# EAGLE board mega2560 (EAGLE 5.11)
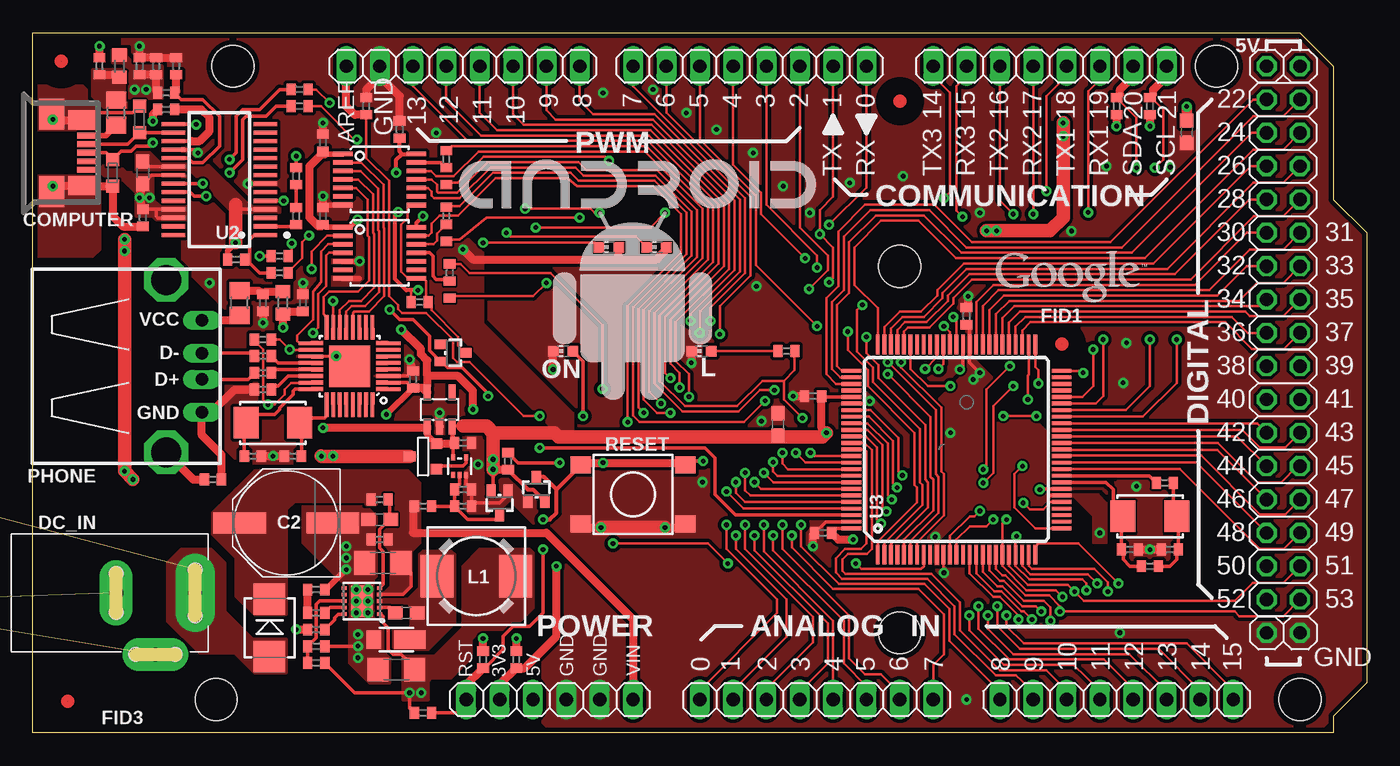
[diagram p2: board, top side]
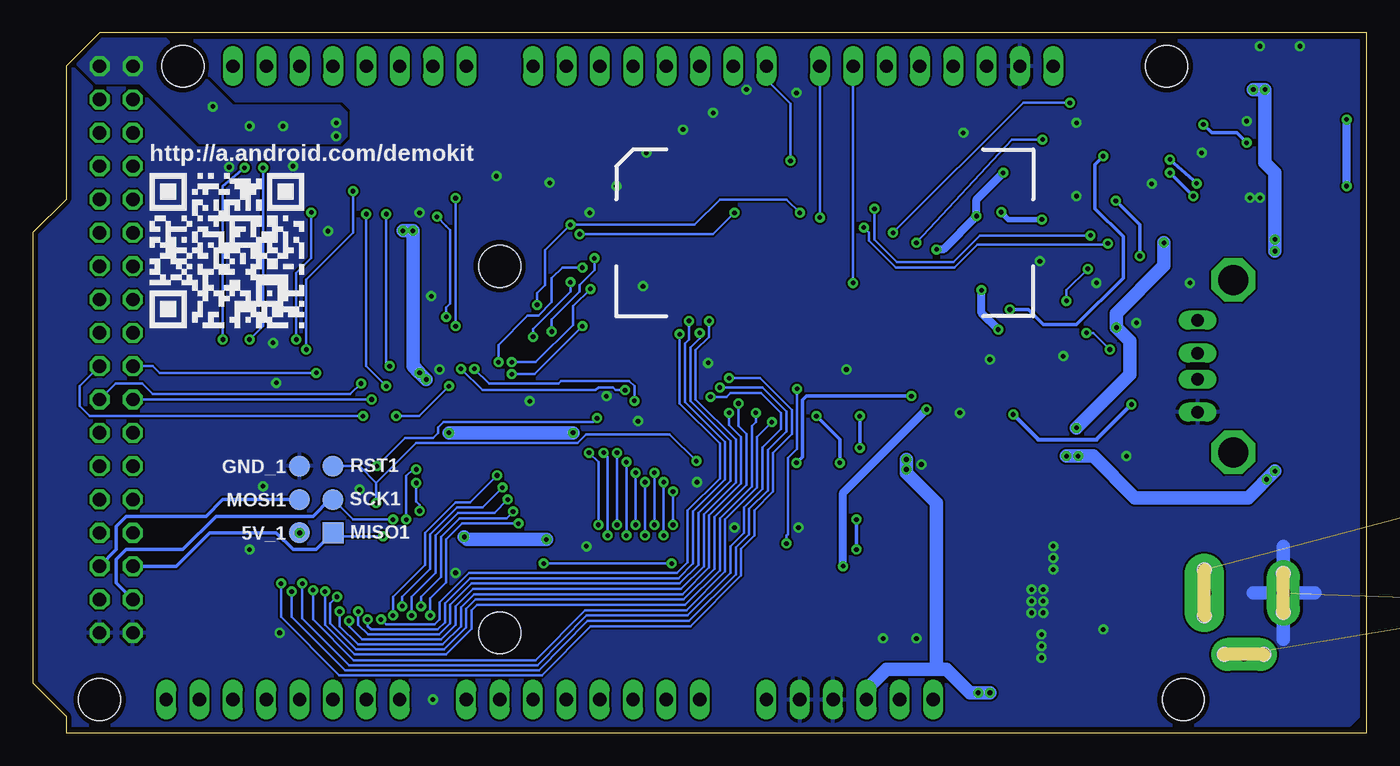
[diagram p3: board, bottom side, seen from below]

Size 101.6 x 53.34 mm. Coordinates in mm from the lower left corner, seen from the top.
Outline: 0,53.34 96.52,53.34 99.06,50.8 99.06,40.64 101.6,38.1 101.6,3.81 99.06,1.27 99.06,0 0,0 0,53.34
Copper layers (1*16): Top 0.035mm / dielectric 1.5mm / Bottom 0.035mm
Design rules "default *": minimum track width 6mil, minimum drill 14mil, track to track 6mil, track to pad 6mil, pad to pad 6mil, via to via 6mil, smd to smd 0mil, copper to edge 15mil, drill to drill 12mil, minimum pad ring 10mil, minimum via ring 8mil, stop-mask expansion 2mil, vias tented up to drill 16mil, thermal gap 10mil
Net classes: 0 default: width 0.152 mm, drill 0.305 mm, clearance 0.152 mm
Holes 3.2 mm at 96.52,2.54 15.24,50.8 90.17,50.8 13.97,2.54 66.04,35.56 66.04,7.62 22.26,-97.56
Holes 0.36 mm at 22.26,-72.16
Holes 0.95 mm at 22.26,-77.24
Holes 1.02 mm at 22.26,-82.32
Holes 1.04 mm at 22.26,-87.4
Holes 2.3 mm at 22.26,-92.48
Milling: 7 lines

## Footprints (pad centres in the part's own frame; a part is rotated, then mirrored left to right if it is on the bottom)
TP16R = smd 1.6 x 1.6: TP 0,0
1X08 = drill 1.016 long: 1 -8.89,0; 2 -6.35,0; 3 -3.81,0; 4 -1.27,0; 5 1.27,0; 6 3.81,0; 7 6.35,0; 8 8.89,0
C0603 = smd 1.1 x 1: 1 -0.85,0; 2 0.85,0
PANASONIC_F = smd 4 x 1.6: + 3.55,0; - -3.55,0
C1206 = smd 1.6 x 1.8: 1 -1.4,0; 2 1.4,0
C0402 = smd 0.7 x 0.9: 1 -0.65,0; 2 0.65,0
MOLEX-47364-0001 = smd 1.7 x 0.45: 1 2.8,1.3; 2 2.8,0.65; 3 2.8,0; 4 2.8,-0.65; 5 2.8,-1.3 | smd 1.9 x 2.375: GND1 0,2.95; GND4 0,-2.95 | smd 2.1 x 1.475: GND2 2.3,2.5; GND3 2.3,-2.5
SMB = smd 2.4 x 2.4: A 2.2,0; C -2.2,0
SOD123PWR = smd 1.1 x 1.4: A -1.7,0 | smd 2.4 x 1.4: K 1.05,0
SC70-3-R = smd 0.7 x 0.9: 1 -0.65,-0.95; 2 0.65,-0.95; 3 0,0.95
DC21 = drill 1.041 pad 3 long: 1 6,0 | drill 1.041 pad 2.5 long: 2 0,0; 3 3,-4.7 | hole 1.041: 0,1.499; 0,-1.499; 6,1.753; 6,-1.753; 1.5,-4.7; 4.5,-4.7
R0805 = smd 1.3 x 1.5: 1 -0.95,0; 2 0.95,0
R0603 = smd 1 x 1.1: 1 -0.85,0; 2 0.85,0
1X01 = drill 1.016 octagon: 1 0,0
CHIP-LED0603 = smd 0.8 x 0.8: A 0,-0.75; C 0,0.75
DR74 = smd 2.5 x 3.25: 1 -3,0; 2 3,0
TP16SQ = smd 1.6 x 1.6: TP 0,0
PN87520 = drill 0.95 long: 1 -3.5,2.71; 2 -1,2.71; 3 1,2.71; 4 3.5,2.71 | drill 2.3 octagon: SG1 -6.57,0; SG2 6.57,0
1X06 = drill 1.016 long: 1 -6.35,0; 2 -3.81,0; 3 -1.27,0; 4 1.27,0; 5 3.81,0; 6 6.35,0
R0402 = smd 0.7 x 0.9: 1 -0.65,0; 2 0.65,0
J0402 = smd 0.7 x 0.9: 1 -0.65,0; 2 0.65,0; 3 1.95,0
B3S-10XX = smd 1.55 x 1.3: 1 3.975,-2.25; 2 -3.975,-2.25; 3 3.975,2.25; 4 -3.975,2.25
SOT-23 = smd 0.787 x 0.889: 1 0.025,-1.016; 2 -0.94,1.016; 3 0.991,1.016
LT-DD-10P-3MMX3MM-SLUG = smd 0.25 x 0.45: 1 -1,-1.35; 2 -0.5,-1.35; 3 0,-1.35; 4 0.5,-1.35; 5 1,-1.35; 6 1,1.35; 7 0.5,1.35; 8 0,1.35; 9 -0.5,1.35; 10 -1,1.35 | smd 2.38 x 1.65: EXP 0,0
SSOP28 = smd 1.8 x 0.317: 1 -3.5,4.225; 2 -3.5,3.575; 3 -3.5,2.925; 4 -3.5,2.275; 5 -3.5,1.625; 6 -3.5,0.975; 7 -3.5,0.325; 8 -3.5,-0.325; 9 -3.5,-0.975; 10 -3.5,-1.625; 11 -3.5,-2.275; 12 -3.5,-2.925; 13 -3.5,-3.575; 14 -3.5,-4.225; 15 3.5,-4.225; 16 3.5,-3.575; 17 3.5,-2.925; 18 3.5,-2.275; 19 3.5,-1.625; 20 3.5,-0.975; 21 3.5,-0.325; 22 3.5,0.325; 23 3.5,0.975; 24 3.5,1.625; 25 3.5,2.275; 26 3.5,2.925; 27 3.5,3.575; 28 3.5,4.225
TQFP100 = smd 1.5 x 0.29: 1 -8,6; 2 -8,5.5; 3 -8,5; 4 -8,4.5; 5 -8,4; 6 -8,3.5; 7 -8,3; 8 -8,2.5; 9 -8,2; 10 -8,1.5; 11 -8,1; 12 -8,0.5; 13 -8,0; 14 -8,-0.5; 15 -8,-1; 16 -8,-1.5; 17 -8,-2; 18 -8,-2.5; 19 -8,-3; 20 -8,-3.5; 21 -8,-4; 22 -8,-4.5; 23 -8,-5; 24 -8,-5.5; 25 -8,-6; 51 8,-6; 52 8,-5.5; 53 8,-5; 54 8,-4.5; 55 8,-4; 56 8,-3.5; 57 8,-3; 58 8,-2.5; 59 8,-2; 60 8,-1.5; 61 8,-1; 62 8,-0.5; 63 8,0; 64 8,0.5; 65 8,1; 66 8,1.5; 67 8,2; 68 8,2.5; 69 8,3; 70 8,3.5; 71 8,4; 72 8,4.5; 73 8,5; 74 8,5.5; 75 8,6 | smd 0.29 x 1.5: 26 -6,-8; 27 -5.5,-8; 28 -5,-8; 29 -4.5,-8; 30 -4,-8; 31 -3.5,-8; 32 -3,-8; 33 -2.5,-8; 34 -2,-8; 35 -1.5,-8; 36 -1,-8; 37 -0.5,-8; 38 0,-8; 39 0.5,-8; 40 1,-8; 41 1.5,-8; 42 2,-8; 43 2.5,-8; 44 3,-8; 45 3.5,-8; 46 4,-8; 47 4.5,-8; 48 5,-8; 49 5.5,-8; 50 6,-8; 76 6,8; 77 5.5,8; 78 5,8; 79 4.5,8; 80 4,8; 81 3.5,8; 82 3,8; 83 2.5,8; 84 2,8; 85 1.5,8; 86 1,8; 87 0.5,8; 88 0,8; 89 -0.5,8; 90 -1,8; 91 -1.5,8; 92 -2,8; 93 -2.5,8; 94 -3,8; 95 -3.5,8; 96 -4,8; 97 -4.5,8; 98 -5,8; 99 -5.5,8; 100 -6,8
SOT-553 = smd 0.3 x 0.45: 1 -0.5,-0.675; 2 0,-0.675; 3 0.5,-0.675; 4 0.5,0.675; 5 -0.5,0.675
SOT23-DBV = smd 0.55 x 1.2: 1 -0.95,-1.3; 2 0,-1.3; 3 0.95,-1.3; 4 0.95,1.3; 5 -0.95,1.3
TSSOP14 = smd 0.35 x 1.5: 1 -1.95,-2.8; 2 -1.3,-2.8; 3 -0.65,-2.8; 4 0,-2.8; 5 0.65,-2.8; 6 1.3,-2.8; 7 1.95,-2.8; 8 1.95,2.8; 9 1.3,2.8; 10 0.65,2.8; 11 0,2.8; 12 -0.65,2.8; 13 -1.3,2.8; 14 -1.95,2.8
TQFP32-05 = smd 0.27 x 1.45: 1 -1.75,-3.16; 2 -1.25,-3.16; 3 -0.75,-3.16; 4 -0.25,-3.16; 5 0.25,-3.16; 6 0.75,-3.16; 7 1.25,-3.16; 8 1.75,-3.16; 17 1.75,3.16; 18 1.25,3.16; 19 0.75,3.16; 20 0.25,3.16; 21 -0.25,3.16; 22 -0.75,3.16; 23 -1.25,3.16; 24 -1.75,3.16 | smd 1.45 x 0.27: 9 3.16,-1.75; 10 3.16,-1.25; 11 3.16,-0.75; 12 3.16,-0.25; 13 3.16,0.25; 14 3.16,0.75; 15 3.16,1.25; 16 3.16,1.75; 25 -3.16,1.75; 26 -3.16,1.25; 27 -3.16,0.75; 28 -3.16,0.25; 29 -3.16,-0.25; 30 -3.16,-0.75; 31 -3.16,-1.25; 32 -3.16,-1.75
TQFN-32 = smd 0.3 x 0.9: 1 -1.75,-2.465; 2 -1.25,-2.465; 3 -0.75,-2.465; 4 -0.25,-2.465; 5 0.25,-2.465; 6 0.75,-2.465; 7 1.25,-2.465; 8 1.75,-2.465; 17 1.75,2.465; 18 1.25,2.465; 19 0.75,2.465; 20 0.25,2.465; 21 -0.25,2.465; 22 -0.75,2.465; 23 -1.25,2.465; 24 -1.75,2.465 | smd 0.9 x 0.3: 9 2.465,-1.75; 10 2.465,-1.25; 11 2.465,-0.75; 12 2.465,-0.25; 13 2.465,0.25; 14 2.465,0.75; 15 2.465,1.25; 16 2.465,1.75; 25 -2.465,1.75; 26 -2.465,1.25; 27 -2.465,0.75; 28 -2.465,0.25; 29 -2.465,-0.25; 30 -2.465,-0.75; 31 -2.465,-1.25; 32 -2.465,-1.75 | smd 3.15 x 3.15: PAD 0,0
XTAL5032 = smd 1.9 x 2.4: 1 -2.05,0; 2 2.05,0
2X08 = drill 1.016 octagon: 1 -8.89,-1.27; 2 -8.89,1.27; 3 -6.35,-1.27; 4 -6.35,1.27; 5 -3.81,-1.27; 6 -3.81,1.27; 7 -1.27,-1.27; 8 -1.27,1.27; 9 1.27,-1.27; 10 1.27,1.27; 11 3.81,-1.27; 12 3.81,1.27; 13 6.35,-1.27; 14 6.35,1.27; 15 8.89,-1.27; 16 8.89,1.27
CT/CN0603 = smd 1 x 1: 1 -1,0; 2 1,0

## Placement (x,y rotation side)
5V_1  TPTP16R  [TP16R]  81.28,15.24 0 bottom
ADCH  [1X08]  82.55,2.54 0 top
ADCL  [1X08]  59.69,2.54 0 top
C1  0.47uF  [C0603]  28.45,9.14 0 top
C2  22uF  [PANASONIC_F]  19.3,16 180 top
C3  4.7uF  [C1206]  26.67,12.95 180 top
C4  220nF  [C0603]  26.42,16.26 180 top
C5  470pF  [C0402]  21.59,10.92 0 top
C6  22uF  [C1206]  27.69,4.83 180 top
C7  10nF  [C0402]  5.08,50.8 90 top
C8  100nF  [C0402]  8.13,50.8 90 top
C9  100nF  [C0402]  10.92,50.8 90 top
C10  100pF  [C0402]  34.29,5.59 90 top
C11  100nF  [C0402]  20.07,42.42 90 top
C12  4.7pF  [C0402]  86.61,13.97 180 top
C13  4.7pF  [C0402]  83.57,13.97 0 top
C14  100nF  [C0402]  10.16,47.5 180 top
C15  100nF  [C0402]  71.12,31.75 90 top
C16  100nF  [C0402]  59.44,25.65 180 top
C17  100nF  [C0402]  60.2,15.24 180 top
C18  1uF  [C0603]  8.38,42.67 270 top
C19  100nF  [C0402]  8.38,39.24 90 top
C20  100nF  [C0402]  25.4,47.75 90 top
C21  100nF  [C0402]  32.77,22.1 180 top
C22  100nF  [C0402]  32.77,18.54 180 top
C23  100nF  [C0402]  36.83,5.59 270 top
C24  10nF  [C0402]  17.53,32.77 270 top
C25  100nF  [C0402]  20.57,32.77 90 top
C26  100nF  [C0402]  22.1,44.96 90 top
C27  13pF  [C0402]  19.81,21.08 180 top
C28  13pF  [C0402]  16.76,21.08 0 top
C29  100nF  [C0402]  22.1,39.37 90 top
C30  100nF  [C0402]  17.53,26.16 180 top
C31  100nF  [C0402]  28.96,26.92 90 top
C32  100nF  [C0402]  13.72,19.3 180 top
C33  100nF  [C0402]  27.94,45.97 90 top
C34  1uF  [C0603]  56.77,23.5 90 top
C35  1uF  [C0603]  87.88,45.8 270 top
COMMUNICATION  [1X08]  77.47,50.8 180 top
COMPUTER  MOLEX-47346-0001  [MOLEX-47364-0001]  1.45,44.2 0 top
D1  SK310B  [SMB]  18.03,8 270 top
D2  DFLS240L  [SOD123PWR]  27.69,7.11 0 top
D3  MMBD7000  [SC70-3-R]  35.56,17.53 180 top
D4  MMBD7000  [SC70-3-R]  32,28.96 270 top
D5  MMBD7000  [SC70-3-R]  38.35,18.54 0 top
DC_IN  PJ-202A  [DC21]  6.35,10.67 0 top
F1  MF-PSMF050X  [R0805]  6.35,47.24 90 top
F2  MF-PSMF050X  [R0805]  15.75,32.77 90 top
FB1  120R  [R0603]  6.6,50.8 90 top
FB2  120R  [R0603]  19.05,32.77 270 top
FID1  [FIDUCIAL_L]  78.38,29.62 0 top
FID2  [FIDUCIAL_R]  2.16,51.18 0 top
FID3  [FIDUCIAL_R]  2.67,2.41 0 top
FID4  [FIDUCIAL_L]  66.04,48.13 0 top
GND_1  TPTP16R  [TP16R]  81.28,20.32 0 bottom
JP1  [1X01]  93.98,50.8 0 top
JP2  [1X01]  96.52,50.8 0 top
JP3  [1X01]  93.98,7.62 0 top
JP4  [1X01]  96.52,7.62 0 top
L  YELLOW  [CHIP-LED0603]  50.93,29.08 90 top
L1  6.8uH  [DR74]  33.78,11.94 0 top
MISO1  TPTP16SQ  [TP16SQ]  78.74,15.24 0 bottom
MOSI1  TPTP16R  [TP16R]  81.28,17.78 0 bottom
ON  GREEN  [CHIP-LED0603]  40.39,29.08 90 top
PHONE  [PN87520]  10.16,27.94 270 top
POWER  [1X06]  39.37,2.54 0 top
PWMH  [1X08]  32.77,50.8 180 top
PWML  [1X08]  54.61,50.8 180 top
R1  16K2  [R0402]  26.42,17.78 180 top
R2  16K2  [R0402]  26.42,14.73 0 top
R3  16K2  [R0402]  21.59,9.14 0 top
R4  536K  [R0402]  21.59,5.33 180 top
R5  1K0  [R0402]  20.32,49.02 0 top
R6  1K0  [R0402]  20.32,47.75 0 top
R7  100K  [R0402]  21.59,6.6 180 top
R8  40K2  [R0402]  21.59,7.87 0 top
R9  1K0  [R0402]  10.16,48.77 0 top
R10  11K  [R0402]  9.4,50.8 270 top
R11  11K  [R0402]  29.72,1.52 180 top
R12  1K0  [R0402]  36.2,20.7 90 top
R13  NOLOAD  [R0402]  85.09,12.7 180 top
R14  100R  [R0402]  20.07,39.37 90 top
R15  33R  [R0402]  86.23,19.05 0 top
R16  1K0  [R0402]  57.4,29.08 180 top
R17  1K0  [R0402]  18.8,36.32 180 top
R18  1K0  [R0402]  18.8,35.05 180 top
R19  11K  [R0402]  29.72,17.27 180 top
R20  5K9  [R0402]  32.77,17.27 180 top
R21  4K7  [R0402]  17.53,29.97 180 top
R22  33R  [J0402]  31.5,42.42 90 top
R23  33R  [R0402]  17.53,28.7 0 top
R24  33R  [R0402]  17.53,27.43 0 top
R25  4K7  [R0402]  85.09,47.75 270 top
R26  4K7  [R0402]  82.55,47.75 270 top
R27  33R  [J0402]  31.5,38.1 90 top
R28  33R  [J0402]  31.75,33.78 90 top
R29  11K  [R0402]  29.46,32.82 0 top
R30  4K7  [R0402]  15.49,36.07 180 top
RESET  B3S-1000  [B3S-10XX]  45.72,18.16 0 top
RST1  TPTP16R  [TP16R]  78.74,20.32 0 bottom
RX  YELLOW  [CHIP-LED0603]  47.5,37.01 90 top
SCK1  TPTP16R  [TP16R]  78.74,17.78 0 bottom
T1  FDN340P  [SOT-23]  29.72,21.08 270 top
TX  YELLOW  [CHIP-LED0603]  43.87,37.01 90 top
U1  LT3480EDD  [LT-DD-10P-3MMX3MM-SLUG]  25.06,10.05 90 top
U2  FT232R  [SSOP28]  14.22,42.16 180 top
U3  ATMEGA1280-16AU  [TQFP100]  70.36,21.59 90 top
U4  74LVC1G17  [SOT-553]  32.51,20.32 0 top
U5  LP2985-33DBVR  [SOT23-DBV]  30.99,24.64 0 top
U6  TXB0104PWR  [TSSOP14]  26.42,42.16 270 top
U7A  MAX3421EEHJ  [TQFP32-05]  24.13,27.94 90 top
U7B  [TQFN-32]  24.13,27.94 90 top
U8  TXB0104PWR  [TSSOP14]  26.42,36.58 270 top
U$1  [A3L-LOC]  -50.8,-167.64 0 top  (outside the outline)
U$3  [QR_AAA_FINAL]  93.09,30.48 0 bottom
U$4  [GOOGLE_10]  72.82,33.22 0 top
U$5  [ANDROID_MARK_25]  32.49,39.98 0 top
U$7  [ROBOT_50_EYES]  39.62,25.4 0 top
X1  16MHz  [XTAL5032]  85.09,16.51 180 top
X2  12MHz  [XTAL5032]  18.29,23.62 0 top
XIOH  [2X08]  95.25,39.37 90 top
XIOL  [2X08]  95.25,19.05 90 top
Z1  PGB1010604  [CT/CN0603]  8.13,46.74 270 top
Z2  PGB1010604  [CT/CN0603]  6.1,42.67 90 top

## Tracks (layer width: path | path; a pad name or v marks a point on that pad's centre or on a via)
+3V3  (via drill 0.36)
  Top 0.203: R21.2 16.88,29.86 17.53,29.21 17.53,25.4 v17.91,25.02 18.41,25.02 19.18,25.78 19.18,26.16 19.68,26.67 20.44,26.67 U7A.23 | R29.1 28.81,33.67 28.75,33.73
  Top 0.254: C31.1 28.54,26.69 U7A.2 U7B.2 | U7A.23 U7B.23
  Top 0.305: v29.34,33.73 28.75,33.73 28.45,33.73 27.58,34.59 27.58,39.42 v27.84,39.67
  Top 0.406: U6.1 22.29,44.11 C26.1 | C29.1 22.29,38.53 U8.1 24.15,38.53 v24.74,39.12 | v26.92,24.26 26.92,24.24 C31.1
  Top 0.61: POWER.2 35.56,3.68 36.81,4.94 C23.2 37.45,4.94 39.88,7.37 v39.88,12.7 | 29.7,26.27 C31.1 | 29.7,26.27 U5.5 | v33.53,24.64 33.53,26.06 32.41,27.18 30.09,27.18 30.04,27.23 | 22.29,44.11 22.02,44.11 21.08,43.18 21.08,39.27 21.74,38.61 21.99,38.61 C29.1 | 30.04,27.23 30.04,26.48 29.83,26.27 29.7,26.27 | v28.07,30.73 29.57,29.23 29.57,28.85 30.04,28.38 30.04,27.23
  Bottom 0.305: v26.92,24.26 25.02,22.35 20.57,22.35 v17.91,25.02
  Bottom 0.406: v24.74,39.12 27.28,39.12 v27.84,39.67
  Bottom 0.61: v33.53,24.64 39.88,18.29 v39.88,12.7 | v28.07,30.73 29.34,32 v29.34,33.73
+5V  (via drill 0.36)
  Top 0.254: U2.20 8.77,43.14 C18.1 | 34.8,18.59 D3.2 35.05,18.62 v35.05,20.07 | U5.3 31.94,22.28 C21.2 32.01,21.99 U4.5 32.01,23.36 32,23.37 32.77,23.37 | R4.1 24.53,3.05 v28.7,3.05 28.7,1.89 R11.2 | U1.1 26.51,9.05 26.67,8.89 26.67,8.38 27.05,8 27.05,6.35 27.43,5.97 28.07,5.97 28.57,5.46 28.57,5.34 C6.1 | U3.100 61.2,15.59 C17.1 | C15.1 71.36,30.86 U3.61 71.36,28.21 v72.14,27.43 | U3.80 60.15,25.59 C16.1 | U3.31 77.53,18.09 | U2.4 15.76,39.89 15.49,39.62 15.49,37.59 v15.44,37.34 | U8.14 29.22,38.89 29.69,39.37 | C34.1 56.49,22.64 56.49,22.55
  Top 0.305: 28.11,44.11 U6.14 | 28.11,44.11 27.69,43.69 v27.69,42.67 | U8.14 29.22,38.87 v29.72,39.37 | 28.11,44.11 27.94,44.29 C33.1 | D5.2 38.75,17.89 38.1,18.54 37.7,18.54 R12.1
  Top 0.406: U5.1 30.04,22.72 T1.2 | R30.2 14.84,36.74 v15.44,37.34
  Top 0.61: C25.1 19.25,32.12 FB2.2 v19.05,30.89 | T1.2 32.04,22.02 C21.2 | v35.05,20.07 36.18,20.07 R12.1 | 62.51,14.79 v62.48,14.73 61.36,14.73 C17.1 | C16.1 60.09,23.23 v60.45,22.86 | R26.2 v82.55,46.23 | R25.2 v85.09,46.23 | U5.1 30.04,23.18 29.97,23.24 v22.1,23.24 | RX.A 48.25,36.82 47.5,36.07 44.7,36.07 | TX.A 44.62,36.16 44.7,36.07 | 44.7,36.07 33.53,36.07 v32.77,36.83
  Top 0.813: C35.1 v87.88,47.73
  Top 1.016: v35.05,20.07 v35.05,20.83 35.05,22.86 | 32.77,23.37 34.54,23.37 35.05,22.86 | 35.05,22.86 39.73,22.86 40.03,22.55 56.49,22.55 60.15,22.55 v60.45,22.86 | v78.49,46.48 v78.49,45.47 78.49,39.27 77.47,38.25 v73.41,38.25 v72.64,38.25 | v15.44,37.34 15.44,40.23
  Bottom 0.61: v27.69,42.67 29.72,40.64 v29.72,39.37 32.26,36.83 v32.77,36.83
  Bottom 1.016: v29.59,3.05 v28.7,3.05 30.23,3.05 32,4.83 32.77,4.83 | 32.77,4.83 36.58,4.83 38.1,3.3 POWER.3 | 32.77,4.83 32.77,17.53 35.05,19.81 v35.05,20.07 v35.05,20.83 | v73.41,38.25 v72.64,38.25 72.64,27.94 v72.14,27.43 v71.63,26.92 | v60.45,22.86 v69.9,22.86 | v15.44,37.34 15.44,35.61 15.49,35.56 19.05,31.95 v19.05,30.89 18.03,29.87 18.03,27.3 v22.1,23.24 | v68.73,14.94 68.53,14.73 v62.48,14.73
  other vias: 81.28,15.24
  pour Top (no thermals): 37.85,13.97 34.04,13.97 32.77,12.7 32.77,8 30.61,5.84 28.32,5.84 28.19,5.71 28.19,2.54 30.1,2.54 30.1,3.94 30.35,4.19 31.88,4.19 33.4,5.71 33.4,7.11 34.16,7.87 36.45,7.87 38.1,9.53 38.1,13.72
  pour Top (no thermals): 7.87,43.94 7.87,42.93 11.94,42.93 12.7,42.16 12.95,42.16 13.72,41.4 13.72,41.15 15.24,39.62 18.8,39.62 18.8,40.13 16.51,40.13 12.95,43.69 11.94,43.69 11.68,43.43 9.65,43.43 8.89,44.2 7.87,44.2
  pour Bottom (no thermals): 96.52,53.09 91.69,53.09 86.36,47.75 78.23,47.75 77.72,47.24 77.72,45.47 78.23,44.96 88.9,44.96 93.47,49.53 96.77,49.53 98.3,51.05 98.3,51.31
  pour Top (no thermals): 77.34,18.16 81.15,18.16 81.79,17.53 81.79,14.48 80.77,14.48 80.77,16.51 79.25,18.03 77.6,18.03 76.58,17.02 71.37,17.02 69.09,14.73 69.09,12.83 68.71,12.83 68.68,14.22 68.2,14.71 68.2,16.28 67.44,16.94 67.44,23.88 71.12,27.56 71.12,31.37 71.5,31.37 71.5,28.7 77.34,22.86
  pour Top (no thermals): 41.15,22.48 35.43,22.48 35.43,19.81 35.18,19.56 34.92,19.56 34.67,19.81 34.67,23.24 39.24,23.24 39.37,23.37 29.97,32.77 29.97,35.81 32,37.85 33.02,37.85 34.29,36.58 34.29,31.24 41.15,24.38
ADC0  (via drill 0.36)
  Top 0.203: v52.83,18.39 54.13,17.09 U3.97 | v52.83,15.85 52.83,14.02 56.69,10.16 56.69,9.14 50.8,3.25 ADCL.1
  Bottom 0.203: v52.83,15.85 v52.83,18.39
ADC1  (via drill 0.36)
  Top 0.203: U3.96 54.24,17.59 53.54,18.29 v53.54,19.1 | ADCL.2 53.34,3.25 57.4,7.32 57.4,10.16 53.54,14.02 v53.54,15.04
  Bottom 0.203: v53.54,15.04 v53.54,19.1
ADC2  (via drill 0.36)
  Top 0.203: v54.25,19.81 54.25,18.49 54.66,18.09 U3.95 | v54.25,15.85 54.25,14.02 59.44,8.84 59.44,6.91 55.88,3.35 ADCL.3
  Bottom 0.203: v54.25,15.85 v54.25,19.81
ADC3  (via drill 0.36)
  Top 0.203: v54.97,19.1 55.48,18.59 U3.94 | ADCL.4 58.42,3.15 60.55,5.28 60.55,8.33 54.97,13.92 v54.97,15.04
  Bottom 0.203: v54.97,15.04 v54.97,19.1
ADC4  (via drill 0.36)
  Top 0.203: ADCL.5 60.96,8.53 55.68,13.82 v55.68,15.85 | v55.68,19.81 56.4,19.09 U3.93
  Bottom 0.203: v55.68,15.85 v55.68,19.81
ADC5  (via drill 0.36)
  Top 0.203: ADCL.6 63.5,3.56 61.77,5.28 61.77,8.53 56.39,13.92 v56.39,15.04 | v56.39,20.62 56.39,19.91 56.71,19.59 U3.92
  Bottom 0.203: v56.39,15.04 v56.39,20.62
ADC6  (via drill 0.36)
  Top 0.203: ADCL.7 66.04,3.05 64.62,4.47 63.4,4.47 62.18,5.69 62.18,8.94 57.1,14.02 v57.1,15.85 | U3.91 57.53,20.09 57.1,20.52 v57.1,21.34
  Bottom 0.203: v57.1,15.85 v57.1,21.34
ADC7  (via drill 0.36)
  Top 0.203: ADCL.8 68.58,5.18 69.39,5.99 69.39,9.04 67.46,10.97 60.96,10.97 57.81,14.12 v57.81,15.04 | v58.12,21.34 58.86,20.59 U3.90
  Bottom 0.203: v57.81,15.04 57.81,21.03 v58.12,21.34
ADC8  (via drill 0.36)
  Top 0.203: ADCH.1 73.66,3.15 69.8,7.01 69.8,9.45 67.89,11.35 61.39,11.35 58.52,14.22 v58.52,15.85 | U3.89 59.48,21.09 v59.23,21.34
  Bottom 0.203: v58.52,15.85 58.52,20.62 v59.23,21.34
ADC9
  Top 0.203: U3.88 63.35,21.59 63.5,21.44 63.5,14.43 63.09,14.02 61.87,14.02 61.16,13.31 61.16,12.22 61.65,11.73 68.12,11.73 70.21,9.65 70.21,7.52 73.36,4.37 74.88,4.37 76.2,3.15 ADCH.2
ADC10
  Top 0.203: U3.87 63.36,22.09 63.91,21.54 63.91,14.02 63.52,13.64 62.08,13.64 61.67,13.23 61.67,12.34 61.9,12.12 68.45,12.12 70.61,9.96 70.61,7.82 73.66,4.78 77.22,4.78 78.74,3.25 ADCH.3
ADC11  (via drill 0.36)
  Top 0.203: U3.86 63.47,22.59 64.31,21.74 64.31,16.26 v64.62,15.95 | ADCH.4 81.28,3.25 79.25,5.18 73.97,5.18 71.32,7.82 v71.32,8.94
  Bottom 0.203: v64.62,15.95 68.89,15.95 70.1,14.73 70.1,11.48 71.32,10.26 v71.32,8.94
ADC12  (via drill 0.36)
  Top 0.203: ADCH.5 83.82,3.35 81.58,5.59 74.37,5.59 72.03,7.92 v72.03,9.65 | U3.85 63.58,23.09 64.72,21.95 64.72,17.17 v65.02,16.87
  Bottom 0.203: v65.02,16.87 65.53,16.36 69.09,16.36 70.51,14.94 70.51,11.89 72.03,10.36 v72.03,9.65
ADC13  (via drill 0.36)
  Top 0.203: ADCH.6 86.36,3.15 83.52,5.99 74.68,5.99 72.75,7.92 v72.75,8.94 | U3.84 63.58,23.59 65.13,22.05 65.13,18.09 v65.43,17.78
  Bottom 0.203: v65.43,17.78 66.45,16.76 69.19,16.76 70.92,15.04 70.92,12.19 72.75,10.36 v72.75,8.94
ADC14  (via drill 0.36)
  Top 0.203: ADCH.7 88.9,3.25 85.75,6.4 75.18,6.4 73.46,8.13 v73.46,9.65 | U3.83 63.69,24.09 65.53,22.25 65.53,19 v65.84,18.69
  Bottom 0.203: v65.84,18.69 67.36,17.17 69.29,17.17 71.32,15.14 71.32,12.5 73.46,10.36 v73.46,9.65
ADC15  (via drill 0.36)
  Top 0.203: v74.17,8.94 74.17,8.13 75.49,6.81 87.88,6.81 91.44,3.25 ADCH.8 | U3.82 63.8,24.59 65.94,22.45 65.94,19.91 v66.24,19.61
  Bottom 0.203: v66.24,19.61 68.28,17.58 69.39,17.58 71.73,15.24 71.73,12.8 74.17,10.36 v74.17,8.94
AREF  (via drill 0.36)
  Top 0.203: v38.61,24.13 37.39,24.13 33.27,28.25 32.31,28.25 32,28.55 32,29.97 29.97,32 28.14,32 27.84,32.31 27.84,32.61 27.15,33.3 27.15,38.68 27.13,38.71 27.13,42.06 25.4,43.79 C20.1
  Top 0.254: U3.98 53.51,16.59 51.94,18.16 51.94,20.95 51.18,21.72 v38.61,21.72
  Top 0.61: PWMH.8 23.88,47.75 24.53,47.1 C20.1
  Bottom 0.254: v38.61,24.13 v38.61,21.72
CMP
  Top 0.254: R19.1 R20.2 | R20.2 C22.2 32.51,18.94 U4.2 | D3.3 35.56,16.51 35.31,16.26 33.13,16.26 R20.2
D+  (via drill 0.36)
  Top 0.254: COMPUTER.3 5.57,44.2 Z2.2 6.1,43.69 6.73,44.32 7.49,44.32 7.87,44.7 8.89,44.7 v9.14,44.96 | U2.15 12.41,46.39 v12.45,46.35
  Bottom 0.254: v9.14,44.96 9.91,45.72 11.81,45.72 v12.45,46.35
D-
  Top 0.254: COMPUTER.2 7.24,44.85 Z1.2 U2.16
DTR
  Top 0.254: R14.2 C11.1
GATE_CMD
  Top 0.254: U4.4 33.01,20.57 32.77,20.32 30.96,20.32 T1.3
GND  (via drill 0.36)
  Top 0.203: U3.11 69.36,12.23 v69.39,12.19 | U7B.3 U7A.3
  Top 0.254: U7A.19 U7B.19 21.83,28.69 v23.11,28.7 | U7A.3 28.57,27.19 C31.2 | 9.4,39.89 C19.2 | 9.4,39.89 U2.25 | U2.26 9.53,39.24 9.4,39.37 9.4,39.89 | U2.21 9.05,42.49 C18.2 | U4.3 33.01,18.95 C22.1 R20.1 33.67,17.53 35.56,17.53 36.21,18.18 D3.1 | R7.1 v24.77,6.6 | U2.18 12.33,44.44 v12.57,44.2 | C16.2 58.78,25.77 | U3.99 60.4,16.09 C17.2 | U3.62 70.86,27.95 v70.61,27.69 | U3.81 63.56,25.09 v63.75,25.27 | U3.32 76.76,18.59 v76.71,18.54 | U2.7 v16.39,41.84 v16.38,41.83
  Top 0.406: C5.2 22.35,10.92 v23.88,12.45 | U6.7 22.29,40.21 C29.2 | U8.5 24.91,35.93 | U8.7 24.85,34.63
  Top 0.61: C12.2 v85.09,13.97 C13.2 | C28.2 v18.29,21.08 C27.2 | C31.2 v28.7,28.45 | C24.2 v17.53,31.24 | C25.2 v20.57,34.29 | C30.2 15.37,26.16 13.72,24.51 12.94,24.51 PHONE.4 12.87,22.69 14.37,21.19 C32.1 | C23.1 v36.83,7.19 | C7.2 v5.08,52.32 | v8.13,52.32 C8.2 R10.1 C9.2 | C18.2 v8.13,40.77 C19.2 | C10.2 v34.29,7.19 | U5.2 v30.99,24.38 | v20.07,7.87 R8.1 | C14.2 9.51,47.48 9.14,47.12 v9.14,46.61 | 26.42,50.04 PWMH.7 | 26.42,50.04 25.4,49.02 C20.2 | v43.28,15.65 42.01,15.65 RESET.2 | v48.16,15.65 49.43,15.65 RESET.1 | v59.44,14.22 59.44,15.13 C17.2 | C15.2 71.25,32.51 v71.25,33.27 | v57.91,25.65 C16.2 | ON.C 39.64,28.21 v39.62,27.69 | L.C 50.18,28.21 v50.16,28.19 | C26.2 v22.1,46.48 | C29.2 v22.1,40.89 | C33.2 27.94,48.51 26.42,50.04
  Top 1.016: v43.28,15.65 v48.16,15.65
  Bottom 1.016: 3.96,10.67 8.64,10.67 | 6.35,7.11 6.35,14.22
  other vias: 33.91,20.45 24.64,10.92 25.53,10.92 24.64,10.03 25.53,10.03 24.64,9.14 25.53,9.14 23.88,13.34 23.88,14.22 24.77,7.49 24.77,5.71 8.89,40.77 24.89,35.94 84.07,18.8 51,19.1 13.46,34.29 55.12,34.04 71.12,2.54 82.8,7.62 83.06,26.67 83.31,29.72 86.64,43.1 81.79,43.18 79.12,38.23 72.14,39.62 66.29,42.42 62.23,41.91 59.18,39.62 57.15,41.66 54.86,44.2 52.07,45.97 49.78,47.24 47.24,49.02 43.43,48.77 30.73,45.72 55.5,23.75
  pour Bottom (rank 2): 0.64,52.7 101.6,52.7 102.23,52.07 102.23,0.64 1.27,0.64 0.64,1.27
  pour Top (rank 3, no thermals): 20.57,17.27 20.57,14.48 24.13,10.92 24.13,5.33 25.65,3.81 27.18,3.81 27.18,7.62 25.91,8.89 25.91,11.68 26.16,11.94 26.16,16.51 25.4,17.27
  pour Top (no thermals): 33.15,22.48 33.15,21.72 33.4,21.46 33.4,20.32 32.89,19.81 32.89,17.14 33.27,16.76 34.67,16.76 35.18,17.27 35.81,17.27 36.58,18.03 36.58,18.92 35.81,18.92 35.81,18.16 35.43,17.78 34.54,17.78 34.29,18.03 34.29,22.23 34.04,22.48
  pour Top (rank 2, no thermals): 3.3,43.18 3.3,42.67 4.83,42.67 5.33,42.16 6.86,42.16 7.87,41.15 7.87,39.37 9.14,39.37 9.4,39.12 11.68,39.12 11.68,40.13 9.65,40.13 9.14,40.64 9.14,42.67 7.11,42.67 6.6,43.18
  pour Top (no thermals): 83.57,19.3 82.8,19.3 82.55,19.05 82.55,16.76 84.84,14.48 84.84,13.72 85.34,13.72 85.34,14.48 86.11,15.24 86.11,18.8 85.6,19.3
  pour Top (isolate 0.254, rank 6, no thermals): 36.83,17.27 38.86,15.24 38.86,0.76 39.62,0 97.79,0 101.6,3.81 101.6,38.1 99.06,40.64 99.06,50.8 96.52,53.34 6.86,53.34 6.86,52.07 7.87,51.05 8.89,51.05 11.43,48.51 11.43,35.56 14.73,32.26 14.73,21.59 15.75,20.57 33.53,20.57
GPX_3V3
  Top 0.203: U8.3 22.49,37.23 21.95,36.68 21.95,34.34 21.34,33.63 21.34,31.5 20.12,30.28 20.12,29.87 20.32,29.67 20.52,29.67 20.5,29.69 U7A.17 U7B.17
GPX_5V
  Top 0.203: U8.12 30.52,37.23 30.79,37.49 30.79,38.04 R27.2
  Top 0.254: R27.2 31.35,38.61
INT_3V3  (via drill 0.36)
  Top 0.203: U8.4 22.55,36.58 22.35,36.37 22.35,34.04 21.74,33.43 21.74,30.89 v21.34,30.48 | 21.88,29.19 U7B.18 U7A.18 19.58,29.19 v19.56,29.21 18.8,29.97 R21.1
  Bottom 0.203: v21.34,30.48 20.83,30.48 v19.56,29.21
INT_5V
  Top 0.254: U8.11 30.23,36.58 30.48,36.32 30.48,34.8 30.73,34.54 31.38,34.54 R28.2
M8RXD  (via drill 0.36)
  Top 0.254: 18.15,36.43 R17.2 v17.27,36.32 | U2.5 v19.1,40.54
  Bottom 0.254: v19.1,40.54 17.27,38.71 v17.27,36.32
M8TXD
  Top 0.254: U2.1 16.86,37.94 16.51,37.59 16.51,36.07 | 16.51,36.07 16.51,35.81 17.27,35.05 R18.2 | 16.51,36.07 R30.1
MISO_3V3  (via drill 0.36)
  Top 0.203: 22.86,31.12 v22.86,32.92 | 22.86,31.12 U7A.15 | U8.2 22.43,37.88 21.23,36.68 v21.23,35.36 | 22.86,31.12 22.88,31.12 U7B.15
  Bottom 0.203: v21.23,35.36 22.86,33.73 v22.86,32.92
MOSI_3V3
  Top 0.203: U6.5 24.63,41.51 25.5,40.64 25.5,37.9 25.63,37.77 25.63,34.47 24.79,33.63 22.55,33.63 22.15,33.22 22.15,31.9 22.35,31.7 22.35,31.13 U7A.16 U7B.16
N$1
  Top 0.61: C32.2 12.23,19.3 PHONE.SG2
N$2
  Top 0.203: L.A R16.2
N$3  (via drill 0.36)
  Top 0.254: ON.A 41.91,28.31 v41.91,24.13 | R12.2 36.97,20.57 v40.13,20.57
  Bottom 0.254: v41.91,24.13 40.13,22.35 v40.13,20.57
N$4  (via drill 0.36)
  Top 0.203: R6.2 21.95,47.75 24.49,45.21 v24.69,45.21 | v34.29,37.34 42.79,37.34 TX.C
  Bottom 0.203: v24.69,45.21 27.03,45.21 v34.29,37.34
N$5  (via drill 0.36)
  Top 0.203: R5.2 21.59,49.02 v22.61,48.01 | v36.07,38.1 36.37,37.8 45.96,37.8 RX.C
  Bottom 0.203: v22.61,48.01 26.16,48.01 v36.07,38.1
N$6
  Top 0.61: R3.1 C5.1
N$7
  Top 0.203: U7A.26 U7B.26
N$8
  Top 0.203: U7A.27 U7B.27
N$9
  Top 0.203: U7A.28 U7B.28
N$10
  Top 0.254: PHONE.2 16.64,28.94 R23.1
N$11
  Top 0.254: PHONE.3 16.38,26.94 R24.1
N$12
  Top 0.203: U7A.20 U7B.20
  Top 0.254: U7A.20 18.69,28.19 R23.2
N$13
  Top 0.203: U7A.21 U7B.21
  Top 0.254: U7A.21 18.43,27.69 R24.2
N$14
  Top 0.61: PHONE.1 15.37,31.44 F2.1
N$15
  Top 0.203: U7A.24 U7B.24
  Top 0.254: U7A.24 19.97,26.19 19.81,26.04 19.81,25.78 18.8,24.77 18.8,24.64 18.41,24.26 16.64,24.26 16.51,24.13 16.51,23.89 X2.1 16.11,23.5 C28.1
N$16
  Top 0.203: U7A.25 U7B.25
  Top 0.254: C27.1 20.46,23.5 X2.2 20.72,24 22.23,24 22.38,24.16 U7A.25
N$17
  Top 0.61: C7.1 6.4,50.15 FB1.1 | F1.2 6.1,48.19
  pour Top (rank 2, no thermals): 4.57,50.55 4.57,48.51 5.59,47.5 7.11,47.5 7.11,50.55
N$18
  Top 0.61: FB2.1 17.73,33.62 C24.1 17.51,33.42 17.27,33.66 15.81,33.66 F2.2
N$19
  Top 0.254: U2.17 12.06,45.09
  Top 0.61: C14.1 12.83,47.5 13.46,46.86 13.46,45.85 12.7,45.09 12.06,45.09
N$20
  Top 0.203: U7A.29 U7B.29
N$21
  Top 0.254: U2.2 19.93,38.59 R14.1
N$22  (via drill 0.36)
  Top 0.254: v14.99,43.69 15.49,44.2 15.49,46.99 16,47.5 17.27,47.5 18.8,49.02 R5.1 | U2.22 12.93,41.84 v12.95,41.86
  Bottom 0.254: v12.95,41.86 13.21,42.11 v14.99,43.69
N$23  (via drill 0.36)
  Top 0.254: U2.23 11.98,41.19 12.27,40.89 v13.21,40.89 | R6.1 18.54,47.75 17.78,46.99 16.26,46.99 16,46.74 16,43.69 v14.99,42.67
  Bottom 0.254: v13.21,40.89 v14.99,42.67
N$24
  Top 0.254: U2.19 11.84,43.79 12.19,43.43 12.95,43.43 14.22,44.7 14.22,46.99 12.95,48.26 11.32,48.26 R9.2
  Top 0.61: C9.1 10.92,48.88 R9.2
N$25
  Top 0.203: U7A.30 U7B.30
N$26
  Top 0.203: U7A.31 U7B.31
N$27
  Top 0.203: U7A.32 U7B.32
N$28
  Top 0.203: U7B.1 U7A.1
N$29
  Top 0.203: U7B.4 U7A.4
N$30
  Top 0.203: U7B.5 U7A.5
N$31
  Top 0.203: U7B.6 U7A.6
N$32
  Top 0.203: U7B.7 U7A.7
N$33
  Top 0.203: U7B.8 U7A.8
N$34
  Top 0.203: U7B.9 U7A.9
N$35
  Top 0.203: U7B.10 U7A.10
N$36
  Top 0.203: U7B.11 U7A.11
N$39
  Top 0.203: U7A.22 U7B.22
  Top 0.254: U7A.22 19.44,27.19 18.67,26.42 18.43,26.42 C30.1
PA0
  Top 0.203: XIOH.16 92.96,48.26 82.09,37.39 71.53,37.39 68.68,40.23 63.4,40.23 61.37,38.2 61.37,34.04 60.45,33.12 60.45,27.33 61.19,26.59 U3.78
PA1
  Top 0.203: U3.77 61.51,27.09 60.86,27.74 60.86,32.82 61.77,33.73 61.77,37.8 63.8,39.83 68.28,39.83 71.12,36.98 82.96,36.98 92.96,46.99 95.25,46.99 XIOH.15
PA2
  Top 0.203: XIOH.14 92.86,45.72 83.72,36.58 70.71,36.58 67.87,39.42 64.21,39.42 62.18,37.39 62.18,33.53 61.27,32.61 61.27,27.94 61.62,27.59 U3.76
PA3
  Top 0.203: U3.75 64.36,32.37 62.59,34.14 62.59,36.98 64.62,39.01 67.46,39.01 70.31,36.17 84.68,36.17 92.96,44.45 95.25,44.45 XIOH.13
PA4
  Top 0.203: XIOH.12 92.76,43.18 85.34,35.76 70.92,35.76 68.89,33.73 68.89,33.33 67.67,32.11 66.04,32.11 64.86,30.92 U3.74
PA5
  Top 0.203: U3.73 65.36,30.81 66.24,31.7 67.87,31.7 69.29,33.12 69.29,33.53 71.12,35.36 86.41,35.36 92.96,41.91 95.25,41.91 XIOH.11
PA6
  Top 0.203: U3.72 65.86,30.7 66.45,31.29 68.07,31.29 69.7,32.92 69.7,33.33 71.32,34.95 86.97,34.95 92.66,40.64 XIOH.10
PA7
  Top 0.203: XIOH.9 95.25,39.37 93.02,39.37 88.19,34.54 71.53,34.54 70.1,33.12 70.1,32.72 68.28,30.89 66.65,30.89 66.36,30.59 U3.71
PB0  (via drill 0.36)
  Top 0.203: XIOL.1 95.25,8.89 91.9,8.89 91.54,9.25 v78.23,9.25 78.23,9.65 77.42,10.46 75.59,10.46 74.07,11.99 73.86,11.99 73.36,12.49 U3.19 | U6.11 30.38,42.16 30.79,41.76 30.79,41.25 30.89,41.15 32.31,41.15 34.65,43.48 41.55,43.48 42.16,42.88 47.55,42.88 50.6,39.83 50.6,36.27 46.53,32.21 46.53,25.4 47.55,24.38 v48.56,24.38
  Bottom 0.203: v78.23,9.25 78.23,8.13 76.83,6.73 70.38,6.73 68.99,8.13 68.99,9.55 67.97,10.57 52.12,10.57 50.09,12.6 50.09,16.56 47.65,19 47.65,22.55 48.56,23.47 v48.56,24.38
PB1  (via drill 0.36)
  Top 0.203: U6.12 30.34,42.81 30.73,42.42 32.05,42.42 33.93,44.3 46.63,44.3 51,39.93 51,36.17 46.94,32.11 46.94,26.01 v47.85,25.09 | v78.44,10.36 77.93,10.87 75.69,10.87 73.86,12.71 U3.20 73.86,15.95 v74.17,16.26
  Bottom 0.203: v74.17,16.26 77.22,16.26 SCK1.TP | v78.44,10.36 78.94,9.86 78.94,8.33 76.96,6.35 70.26,6.35 68.58,8.03 68.58,9.45 67.87,10.16 52.02,10.16 49.68,12.5 49.68,16.46 47.24,18.9 47.24,22.76 47.85,23.37 v47.85,25.09
  Bottom 0.254: SCK1.TP 78.99,17.78 80.26,16.51 87.63,16.51 90.17,13.97 94.49,13.97 95.25,13.21 95.25,11.43 XIOL.2
PB2  (via drill 0.36)
  Top 0.203: XIOL.3 95.25,11.43 92.91,11.43 91.54,10.06 80.06,10.06 v79.35,10.77 78.84,11.28 75.79,11.28 74.36,12.71 U3.21 | U6.10 30.11,41.51 30.38,41.25 30.38,40.95 30.58,40.74 32.51,40.74 34.85,43.08 41.35,43.08 41.96,42.47 47.45,42.47 50.19,39.73 50.19,36.37 46.13,32.31 46.13,24.79 v46.53,24.38
  Bottom 0.203: v79.35,10.77 79.35,8.23 77.09,5.97 70.13,5.97 68.17,7.92 68.17,9.35 67.77,9.75 51.92,9.75 49.28,12.39 49.28,16.36 46.84,18.8 46.84,23.37 46.53,23.67 v46.53,24.38
  Bottom 0.254: XIOL.3 95.25,13.97 95.25,15.75 94.49,16.51 88.39,16.51 87.12,17.78 MOSI1.TP
PB3  (via drill 0.36)
  Top 0.203: U8.13 30.15,37.88 30.38,38.1 30.38,38.81 30.99,39.42 32.41,39.42 35.26,42.27 40.74,42.27 41.45,41.66 47.24,41.66 49.38,39.52 49.38,36.58 45.31,32.51 v45.31,23.67 | v80.26,10.87 80.26,11.38 79.96,11.68 75.89,11.68 74.86,12.72 U3.22 74.86,14.91 v74.93,14.99
  Bottom 0.203: v74.93,14.99 78.49,14.99 MISO1.TP | v80.26,10.87 80.26,8.64 77.17,5.54 63.3,5.54 59.54,9.35 51.82,9.35 48.87,12.29 48.87,16.26 46.43,18.69 46.43,22.55 v45.31,23.67
  Bottom 0.254: XIOL.4 90.68,12.7 88.14,15.24 83.06,15.24 81.79,13.97 80.01,13.97 MISO1.TP
PB4  (via drill 0.36)
  Top 0.203: PWMH.3 36.58,47.14 37.39,46.33 47.14,46.33 53.03,40.44 53.03,35.36 48.97,31.29 48.97,28.35 49.99,27.33 v49.99,25.6 | U3.23 75.36,12.73 76,12.09 80.37,12.09 v81.08,11.38
  Bottom 0.203: v81.08,11.38 81.08,8.74 77.5,5.16 63.17,5.16 59.44,8.94 51.71,8.94 48.46,12.19 48.46,14.22 47.45,15.24 47.45,17.17 46.02,18.59 46.02,21.74 44.6,23.16 44.6,24.38 46.13,25.91 48.46,25.91 48.77,25.6 v49.99,25.6
PB5  (via drill 0.36)
  Top 0.203: PWMH.4 34.04,47.24 35.36,45.92 47.04,45.92 52.63,40.34 52.63,35.56 48.56,31.5 48.56,28.14 49.28,27.43 v49.28,26.31 | U3.24 75.86,12.74 76.1,12.5 80.87,12.5 81.89,11.48 v81.89,10.77
  Bottom 0.203: v81.89,10.77 81.89,8.84 77.83,4.78 63.04,4.78 59.33,8.53 51.61,8.53 48.06,12.09 48.06,14.12 47.04,15.14 47.04,17.07 45.62,18.49 45.62,21.54 44.2,22.96 44.2,24.49 46.02,26.31 v49.28,26.31
PB6  (via drill 0.36)
  Top 0.203: PWMH.5 31.5,48.16 34.14,45.52 46.94,45.52 52.22,40.23 52.22,35.76 48.16,31.7 48.16,27.43 v48.56,27.03 | U3.25 76.36,14.18 76.61,14.43 79.65,14.43 v82.7,11.38
  Bottom 0.203: v82.7,11.38 82.7,8.84 78.26,4.39 62.81,4.39 59.13,8.13 51.51,8.13 47.65,11.99 47.65,14.02 46.63,15.04 46.63,16.97 45.21,18.39 45.21,21.34 43.79,22.76 43.79,24.59 46.23,27.03 v48.56,27.03
PB7  (via drill 0.36)
  Top 0.203: R16.1 57.91,29.26 | PWMH.6 28.96,49.28 33.12,45.11 46.84,45.11 51.82,40.13 51.82,35.87 47.75,31.8 47.75,26.82 49.68,24.89 53.65,24.89 55.58,26.82 57.2,26.82 | R16.1 58.05,29.02 58.22,28.85 | U3.26 76.36,15.59 74.78,17.17 74.78,19.71 v75.39,20.32 | v58.62,23.98 57.2,25.4 57.2,26.82 | 57.2,26.82 58.01,27.64 58.01,29.04 R16.1
  Bottom 0.203: v75.39,20.32 73.25,22.45 71.12,22.45 70.71,22.86 70.71,23.27 70.31,23.67 58.93,23.67 v58.62,23.98
PC0
  Top 0.203: U3.53 75.36,30.65 76,31.29 90.83,31.29 92.86,29.26 95.3,29.26 XIOH.1
PC1
  Top 0.203: U3.54 74.86,30.97 75.59,31.7 91.34,31.7 92.56,30.48 XIOH.2
PC2
  Top 0.203: U3.55 74.36,31.28 75.18,32.11 92.35,32.11 92.71,31.75 95.25,31.75 XIOH.3
PC3
  Top 0.203: U3.56 73.86,31.59 74.78,32.51 93.47,32.51 XIOH.4
PC4
  Top 0.203: U3.57 73.36,31.91 74.37,32.92 91.85,32.92 93.22,34.29 95.25,34.29 XIOH.5
PC5
  Top 0.203: U3.58 72.86,32.22 73.97,33.33 90.22,33.33 92.46,35.56 XIOH.6
PC6
  Top 0.203: U3.59 72.36,32.53 73.56,33.73 89.61,33.73 92.71,36.83 95.25,36.83 XIOH.7
PC7
  Top 0.203: U3.60 71.86,32.84 73.15,34.14 88.49,34.14 92.46,38.1 XIOH.8
PD7  (via drill 0.36)
  Top 0.203: U3.50 79.85,27.59 v80.01,27.43
  Bottom 0.203: v80.01,27.43 91.95,27.43 92.46,27.94 XIOL.16
PE0  (via drill 0.36)
  Top 0.203: PWML.1 63.5,41.55 v60.66,38.71 | v63.2,32.61 62.79,32.21 62.79,29.06 64.01,27.84 64.01,26.72 67.56,23.16 67.56,19.1 67.77,18.9 67.77,17.37 64.86,14.46 U3.2 | v37.49,39.93 42.47,39.93 42.77,39.62 v43.18,39.62 | R18.1 19.45,35.09 20.52,36.17 20.52,36.98 20.52,37.39 v21.03,37.9
  Bottom 0.203: v63.2,32.61 63.2,33.53 62.59,34.14 62.59,36.78 v60.66,38.71 51.21,38.71 49.28,40.64 44.2,40.64 v43.18,39.62 | v37.49,39.93 37.49,37.59 35.76,35.87 31.5,35.87 29.46,37.9 v21.03,37.9
PE1  (via drill 0.36)
  Top 0.203: PWML.2 60.96,40.84 59.94,39.83 v59.94,38 60.96,36.98 60.96,34.65 v60.66,34.34 | v63.5,30.18 63.5,28.96 64.41,28.04 64.41,27.03 67.97,23.47 67.97,19.3 68.17,19.1 68.17,17.17 65.36,14.36 U3.3 | v38.3,38.51 47.04,38.51 v48.16,39.62 | v19.71,37.29 19.71,36.67 R17.1
  Bottom 0.203: v60.66,34.34 60.66,33.63 63.5,30.79 v63.5,30.18 | v19.71,37.29 19.81,37.19 29.67,37.19 31.39,35.46 35.87,35.46 37.9,37.49 37.9,38.1 v38.3,38.51 | v59.94,38 49.78,38 v48.16,39.62
PE3  (via drill 0.36)
  Top 0.203: v65.13,27.33 68.38,24.08 68.38,19.51 68.58,19.3 68.58,16.97 66.36,14.74 U3.5 | PWML.6 50.8,45.21 55.07,40.95 55.07,36.07 55.07,35.66 v59.74,30.99
  Bottom 0.203: v65.13,27.33 63.4,27.33 v59.74,30.99
PE4  (via drill 0.36)
  Top 0.203: PWML.3 58.42,38.51 60.55,36.37 60.55,35.26 v59.13,33.83 | v65.13,28.25 68.78,24.59 68.78,19.71 68.99,19.51 68.99,16.76 66.86,14.64 U3.6
  Bottom 0.203: v65.13,28.25 63.3,28.25 60.45,31.09 60.45,32.51 v59.13,33.83
PE5  (via drill 0.36)
  Top 0.203: v59.74,35.46 59.74,36.37 55.88,40.23 PWML.4 | v66.14,28.25 66.14,27.84 69.19,24.79 69.19,19.91 69.39,19.71 69.39,16.56 67.36,14.53 U3.7
  Bottom 0.203: v59.74,35.46 61.27,35.46 62.08,34.65 62.08,32.82 63.09,31.8 63.91,31.8 66.14,29.57 v66.14,28.25
PE6  (via drill 0.36)
  Top 0.203: R28.3 32.59,35.73 33.27,35.05 39.42,35.05 43.38,31.09 v43.38,26.21 | U3.8 67.86,12.69 67.67,12.5 63.12,12.5 v62.69,12.9 | v44.2,14.43 51.41,14.43 v52.93,12.9
  Bottom 0.203: v44.2,14.43 44.2,15.04 44.09,15.14 44.09,20.93 43.38,21.64 v43.38,26.21 | v52.93,12.9 v62.69,12.9
PG0  (via drill 0.36)
  Top 0.203: v76.61,26.62 76.61,27.64 76.36,27.88 U3.51
  Bottom 0.203: XIOL.13 95.3,26.62 93.27,26.62 92.46,25.81 77.42,25.81 v76.61,26.62
PG1  (via drill 0.36)
  Top 0.203: v75.79,25.4 75.79,27.23 75.86,27.29 U3.52
  Bottom 0.203: v75.79,25.4 XIOL.14
PG2  (via drill 0.36)
  Top 0.203: v73.91,24.13 v76.45,24.13 | v69.9,26.42 68.17,26.42 66.86,27.73 U3.70
  Bottom 0.203: v76.45,24.13 97.28,24.13 98.04,24.89 98.04,26.42 XIOL.15 | v69.9,26.42 72.19,24.13 v73.91,24.13
PG5  (via drill 0.36)
  Top 0.203: v62.08,30.58 62.08,29.16 63.6,27.64 63.6,26.42 67.16,22.86 67.16,18.9 67.36,18.69 67.36,17.58 64.36,14.57 U3.1 | PWML.5 53.34,43.28 55.47,41.15 55.47,39.52 v58.83,36.17
  Bottom 0.203: v62.08,30.58 62.08,31.5 59.94,33.63 59.94,34.14 58.83,35.26 v58.83,36.17
PH3  (via drill 0.36)
  Top 0.203: U3.15 71.36,12.16 73.15,10.36 73.66,10.36 75.08,8.94 v75.08,8.64 | PWML.7 48.26,47.24 54.66,40.84 54.66,34.85 52.32,32.51 v52.32,30.38
  Bottom 0.203: v75.08,8.64 74.7,8.26 70.99,8.26 70.61,8.64 70.61,9.96 68.38,12.19 52.53,12.19 51.71,13.01 51.71,16.97 49.28,19.41 49.28,22.05 52.32,25.09 v52.32,30.38
PH4  (via drill 0.36)
  Top 0.203: R22.1 31.64,41.77 31.5,41.91 32.36,41.91 34.34,43.89 43.59,43.89 v43.89,43.59 | U3.16 71.86,12.16 73.25,10.77 73.76,10.77 75.29,9.25 75.49,9.25 v76.1,8.64 | v51.61,31.39 51.61,32.41 54.25,35.05 54.25,40.74 45.72,49.28 PWML.8
  Bottom 0.203: PWML.8 45.72,49.78 43.89,47.95 v43.89,43.59 | v76.1,8.64 76.1,8.13 75.84,7.87 70.76,7.87 70.21,8.43 70.21,9.86 68.28,11.79 52.43,11.79 51.31,12.9 51.31,16.87 48.87,19.3 48.87,22.15 51.92,25.2 51.92,29.67 51.61,29.97 v51.61,31.39
PH5  (via drill 0.36)
  Top 0.203: PWMH.1 41.66,48.16 42.67,47.14 47.35,47.14 53.85,40.64 53.85,35.15 50.8,32.11 v50.8,30.48 | R27.1 31.61,37.45 31.75,37.59 32.51,37.59 34.54,39.27 v41.66,39.27 | U3.17 72.36,12.28 73.46,11.18 73.86,11.18 75.39,9.65 76.4,9.65 v76.81,9.25
  Bottom 0.203: PWMH.1 v41.66,39.27 | v76.81,9.25 76.81,8.23 76.07,7.49 70.64,7.49 69.8,8.33 69.8,9.75 68.17,11.38 52.32,11.38 50.9,12.8 50.9,16.76 48.46,19.2 48.46,22.25 51.51,25.3 51.51,29.36 50.8,30.07 v50.8,30.48
PH6  (via drill 0.36)
  Top 0.203: PWMH.2 39.12,47.45 39.83,46.74 47.24,46.74 53.44,40.54 53.44,35.26 50.09,31.9 v50.09,31.39 | R28.1 31.61,33.13 31.75,33.27 38.1,33.27 v39.12,34.29 | U3.18 72.86,12.38 73.66,11.58 73.97,11.58 75.49,10.06 77.01,10.06 77.52,9.55 v77.52,8.53
  Bottom 0.203: PWMH.2 v39.12,34.29 | v77.52,8.53 77.52,8.13 76.5,7.11 70.51,7.11 69.39,8.23 69.39,9.65 68.07,10.97 52.22,10.97 50.49,12.7 50.49,16.66 48.06,19.1 48.06,22.35 51.1,25.4 51.1,29.16 50.09,30.18 v50.09,31.39
PJ2  (via drill 0.36)
  Top 0.203: U3.65 69.36,28.11 v68.99,27.74 | R22.3 31.6,44.4 31.9,44.7 46.74,44.7 51.41,40.03 51.41,36.07 47.35,32 47.35,26.62 49.48,24.49 53.75,24.49 55.37,26.11 v56.49,26.11
  Bottom 0.203: v68.99,27.74 67.36,26.11 58.73,26.11 58.52,26.31 57.4,26.31 57.2,26.11 v56.49,26.11
PJ3  (via drill 0.36)
  Top 0.203: R27.3 31.67,40.05 31.75,40.13 32.51,40.13 35.05,42.67 40.95,42.67 41.55,42.06 47.35,42.06 49.78,39.62 49.78,36.47 45.72,32.41 45.72,24.18 46.23,23.67 54.15,23.67 v55.78,25.3 | U3.66 68.86,28.62 v67.97,27.74
  Bottom 0.203: v67.97,27.74 66.85,26.62 61.57,26.62 61.37,26.82 56.19,26.82 55.78,26.42 v55.78,25.3
PL0
  Top 0.203: U3.35 78.39,20.12 87.38,20.12 93.47,14.02 95.3,14.02 XIOL.5
PL1
  Top 0.203: XIOL.6 88.63,20.59 U3.36
PL2
  Top 0.203: U3.37 78.4,21.13 89,21.13 93.47,16.66 95.4,16.66 XIOL.7
PL3
  Top 0.203: XIOL.8 90.22,21.54 78.41,21.54 U3.38
PL4
  Top 0.203: XIOL.9 96.32,20.32 95.1,19.1 93.27,19.1 90.28,22.09 U3.39
PL5
  Top 0.203: U3.40 91.71,22.59 XIOL.10
PL6
  Top 0.203: XIOL.11 95.4,21.74 93.47,21.74 92.12,23.09 U3.41
PL7
  Top 0.203: XIOL.12 93.27,23.57 78.38,23.57 U3.42
PWRIN
  pour Top (no thermals): 19.18,7.11 16.76,7.11 14.61,9.27 14.61,12.95 13.59,13.97 11.3,13.97 10.29,12.95 10.29,8.51 12.7,6.1 15.37,6.1 16.89,4.57 19.18,4.57 19.3,4.57 19.3,7.11
RESET  (via drill 0.36)
  Top 0.203: U3.30 77.53,17.59 76.96,17.02 75.95,17.02 v75.44,17.53
  Top 0.254: R11.1 32.51,1.52 33.02,2.03 POWER.1 | C10.1 34.4,4.94 35.81,6.35 35.81,7.37 36.58,8.13 37.85,8.13 38.86,9.14 v38.86,13.97 | v20.07,43.94 C11.2 | v34.67,25.65 34.67,25.86 34.37,26.16 32.7,27.84 31.6,27.84 31.13,28.31 D4.2 30.23,29.13 30.23,30.23 28.96,31.5 27.94,31.5 v27.18,32.26 | v51.05,20.7 49.98,20.7 RESET.3
  Top 0.305: v38.86,16.26 39.37,16.26 39.88,16.76 39.88,18.54 | 39.88,18.54 RESET.4 | D5.3 38.93,19.49 39.88,18.54
  Top 0.61: POWER.1 33.02,3.67 C10.1 | RESET.4 41.87,20.41 42.04,20.57 v43.43,20.57 49.53,20.57 RESET.3
  Bottom 0.203: 75.44,19.05 v75.44,17.53 | 75.44,19.05 76.71,20.32 RST1.TP | 75.44,19.05 72.39,22.1 60.1,22.1 59.46,22.73 53.09,22.73 v51.05,20.7
  Bottom 0.254: v38.86,13.97 v38.86,16.26 | v20.07,43.94 20.7,43.31 20.7,39.95 18.54,37.8 18.54,34.67 22.1,31.11 24.64,31.11 25.78,32.26 v27.18,32.26 | v34.67,25.65 42.67,25.65 42.98,25.35 42.98,21.03 v43.43,20.57
RST_3V3
  Top 0.203: U6.2 25.01,43.46 26.72,41.76 26.72,38.51 26.77,38.46 26.77,33.27 25.6,32.11 24.49,32.11 24.38,32 U7A.12 U7B.12
RST_5V
  Top 0.254: 31.35,43.21 R22.2 31.1,43.46 U6.13
RUN_SS
  Top 0.254: R1.1 27.18,17.27 27.18,16 C4.1 26.92,16 26.42,15.49 26.42,14.1 26.67,13.84 26.67,11.3 26.42,11.06 U1.5
RXD1  (via drill 0.36)
  Top 0.203: U3.45 80.97,25.09 81.53,25.65 v81.53,29.97 | v80.39,39.65 80.39,48.9 81.28,49.78 COMMUNICATION.3
  Bottom 0.203: v80.39,39.65 80.39,36.2 81.53,35.05 v81.53,29.97
RXD2  (via drill 0.36)
  Top 0.203: v76.2,39.52 COMMUNICATION.5 | v74.68,26.42 73.15,24.89 73.15,19.81 v72.39,19.05 | U3.12 69.86,14.99 71.37,16.51 71.68,16.51 71.7,16.51 71.73,16.51 v72.14,16.92
  Bottom 0.203: v76.2,39.52 76.2,27.94 v74.68,26.42 | v72.39,19.05 72.39,17.63 72.14,17.37 v72.14,16.92
RXD3  (via drill 0.36)
  Top 0.203: COMMUNICATION.7 71.12,50.04 70.36,49.28 70.36,39.78 v70.81,39.32 | U3.63 70.36,31.45 v70.1,31.7
  Bottom 0.203: v70.81,39.32 70.1,38.61 69.8,38.3 69.8,32.72 70.1,32.41 v70.1,31.7
SCK_3V3
  Top 0.203: U6.3 24.95,42.81 26.31,41.45 26.31,38.3 26.39,38.23 26.39,33.6 25.3,32.51 24.28,32.51 23.88,32.11 U7A.13 U7B.13
SCL  (via drill 0.36)
  Top 0.203: U3.43 84.54,24.09 87.12,26.67 v87.12,29.97 | R25.1 85.23,48.26 85.34,48.26 86.11,47.5 86.11,43.69 v85.47,43.05
  Top 0.61: COMMUNICATION.1 86.36,50.04 85.34,49.02 85.34,48.66 R25.1
  Bottom 0.203: v85.47,43.05 87.12,41.66 v87.12,29.97
SDA  (via drill 0.36)
  Top 0.203: 82.8,48.66 R26.1 84.07,46.88 v84.07,43.05 | U3.44 83.26,24.59 85.09,26.42 v85.09,29.97
  Top 0.61: COMMUNICATION.2 83.82,50.04 82.8,49.02 82.8,48.66
  Bottom 0.203: v85.09,29.97 84.07,30.99 v84.07,43.05
SPI_OE
  Top 0.203: D4.3 32.41,29.5 32.41,30.18 30.38,32.21 30.38,32.55 R29.2 29.97,32.82 | 29.97,32.82 29.97,32.61 | 29.97,32.82 29.97,34.44 29.79,34.63 U8.8 29.2,34.65 28.55,34.65 28.04,35.15 28.04,38.71 28.55,39.22 28.55,40.13 28.63,40.21 U6.8
SS_3V3
  Top 0.203: U6.4 24.79,42.16 25.91,41.05 25.91,38.1 26.01,38 26.01,33.93 24.99,32.92 24.08,32.92 23.38,32.22 U7A.14 U7B.14
SW_RT
  Top 0.254: U1.10 23.27,9.05 22.99,8.76 22.99,8.62 R8.2
SW_VC
  Top 0.254: U1.9 22.64,9.55 R3.2
TXD1  (via drill 0.36)
  Top 0.203: U3.46 79.95,25.59 80.77,26.42 v80.77,29.21 | COMMUNICATION.4 78.74,50.04 77.22,48.51 v77.22,41.27
  Bottom 0.203: v80.77,29.21 80.77,34.54 77.22,38.1 v77.22,41.27
TXD2  (via drill 0.36)
  Top 0.203: COMMUNICATION.6 73.66,40.54 v74.68,39.52 | v74.42,27.94 72.64,26.16 72.64,20.32 v72.39,20.07 | U3.13 70.36,14.73 71.37,15.75 72.64,15.75 v73.15,16.26
  Bottom 0.203: v74.68,39.52 74.68,28.19 v74.42,27.94 | v72.39,20.07 72.64,20.07 73.15,19.56 v73.15,16.26
TXD3  (via drill 0.36)
  Top 0.203: COMMUNICATION.8 68.58,50.04 69.86,48.76 69.86,41.21 v69.39,40.74 | U3.64 69.86,30.52 v69.39,30.99
  Bottom 0.203: v69.39,30.99 v69.39,40.74
USBVCC  (via drill 0.36)
  Top 0.61: C8.1 R10.2 9.4,48.88 R9.1 | v6.99,36.7 6.99,36.83
  Top 1.016: T1.1 22,21.06 v21.97,21.08 | v6.99,36.7 v6.99,19.94 v7.62,19.3 | 6.99,36.83 v6.99,37.59
  Bottom 1.016: v8.64,49.02 v7.75,49.02 7.75,43.43 6.99,42.67 v6.99,36.7 | v6.99,19.94 9.02,17.91 17.65,17.91 20.83,21.08 v21.97,21.08 v22.86,21.08
  pour Top (no thermals): 6.1,52.07 6.1,51.05 6.86,51.05 7.37,50.55 7.37,48.36 9.86,48.36 9.86,50.8 7.87,50.8 7.11,51.56 7.11,52.07
USHIELD  (via drill 0.36)
  Top 0.254: Z1.1 8.11,47.74 7.62,47.24 4.3,47.24 COMPUTER.GND2
  Top 0.61: COMPUTER.GND2 1.9,46.7 COMPUTER.GND1 | 1.9,41.7 COMPUTER.GND3 3.77,41.67 Z2.1 6.1,39.37 6.87,38.59 C19.1 | COMPUTER.GND4 1.9,41.7 | 1.9,41.7 1.56,41.7 v1.52,41.66
  Bottom 0.61: v1.52,41.66 v1.52,46.74
  pour Top (no thermals): 0,45.97 4.83,45.97 4.83,47.5 4.06,48.26 4.06,49.02 3.81,49.28 0,49.28
  pour Top (no thermals): 0,42.42 4.83,42.42 5.08,42.16 5.08,36.83 4.57,36.32 0,36.32
VBOOST
  Top 0.254: U1.2 27.2,9.55 C1.1
VFB
  Top 0.254: U1.8 21.86,10.05 21.59,9.78 21.59,7.25 R7.2 R4.2
VIN
  Top 0.254: U1.4 28.2,10.55 28.83,11.18 28.83,12.2 C3.1
  Top 0.61: POWER.6 45.72,8.64 39.12,15.24 28.96,15.24 28.96,17.16 R19.2
  pour Top (rank 2, no thermals): 26.29,10.41 26.29,10.67 26.8,10.67 27.3,11.18 27.3,13.84 26.8,14.35 26.8,16.26 27.69,16.26 27.69,18.16 27.56,18.29 26.54,18.29 26.16,17.91 26.16,17.4 25.4,17.4 25.4,17.65 19.94,17.65 19.3,17.02 19.3,9.02 16.89,9.02 15.49,10.41 15.49,13.34 13.72,15.11 13.72,16.76 16.89,19.94 28.57,19.94 29.46,19.05 29.46,14.48 28.83,13.84 28.83,11.18 28.07,10.41
VSW
  pour Top (no thermals): 26.67,10.16 26.29,10.16 26.29,9.91 28.57,9.91 28.83,9.65 28.83,8.13 28.57,7.87 27.43,7.87 27.43,6.35 30.1,6.35 32.13,8.38 32.13,13.59 31.88,13.84 29.72,13.84 29.46,13.59 29.46,11.05 28.57,10.16
XTAL1
  Top 0.254: C12.1 87.26,13.86 | C12.1 87.26,16.39 X1.1 86.87,16.78 86.87,17.02 86.88,17.03 R15.2 | R13.1 86.61,12.7 87.12,13.21 87.12,13.83 C12.1
XTAL1R
  Top 0.254: R15.1 85.04,19.59 U3.34
XTAL2
  Top 0.254: C13.1 82.92,15.86 83.06,16 83.06,16.49 X1.2 82.55,17 82.55,17.27 82.3,17.53 82.3,18.54 81.75,19.09 U3.33 | C13.1 82.92,13.86 | R13.2 83.57,12.7 83.06,13.21 83.06,13.83 C13.1
XVCC
  Top 0.406: COMPUTER.1 5.55,45.5 F1.1

## Text on the board
Top: Top | 2
Bottom: Bottom | 3
tPlace: 9 | 8 | 7 | 6 | 5 | 4 | 3 | 2 | 1 | 0 | 22 | 14 | 15 | 16 | 17 | 18 | 19 | 20 | 21 | 13 | 12 | 11 | 10 | 24 | 26 | 28 | 30 | 31 | 32 | 33 | 34 | 35 | 36 | 37 | 38 | 39 | 40 | 41 | 42 | 43 | 44 | 45 | 46 | 47 | 48 | 49 | 50 | 51 | 52 | 53 | 0 | 1 | 2 | 3 | 4 | 5 | 6 | 7 | 8 | 9 | 10 | 11 | 12 | 13 | 14 | 15
bPlace: http://a.android.com/demokit
tNames: 5V | AREF | GND | PWM | TX | RX | TX3 | RX3 | TX2 | RX2 | TX1 | RX1 | SDA | SCL | DIGITAL | ANALOG IN | GND | RST | 3V3 | 5V | GND | GND | VIN
Holes: DRILL PLAN | SYM | SIZE | TOL. | CNT | PLATE | 0.014 in | +/-0.003 in | 247 | Yes | 0.037 in | +/-0.003 in | 4 | Yes | 0.040 in | +/-0.003 in | 82 | Yes | 0.041 in | +/-0.003 in | 9 | Yes | Mark Extents of 3 Plated Slots (3 per slot to mark ends and center) | 0.091 in | +/-0.003 in | 2 | Yes | 0.126 in | +/-0.003 in | 6 | No | TOTAL | 350 | Drills and Milling
Milling: 0.138"x0.04" LxW Slot | 4. | 0.118"x0.04" LxW Slots | 4
Measures: 3.8" | 3.9" | 2.1" | 2.0" | 1.6" | 1.5" | 0.15" | 0.0" | 0.05" | 0.0" | 3.9" | 4.0"
Document: of 4 | C
ReferenceLC: NOTES: | 1. MATERIAL: MAKE FROM EPOXY GLASS (NEMA-GR-FR4), | COPPER CLAD LAMINATE WITH 1 OZ. COPPER ON | OUTER LAYERS. 2 LAYERS, RoHS COMPATIBLE | 2. PLATING | A. APPLY WHITE SOLDER MASK OVER BARE COPPER (SMOBC) | WITH LIQUID PHOTO-IMAGEABLE SOLDERMASK | B. PLATE EXPOSED PADS WITH RoHS COMPLIANT MATERIAL | 3. SILKSCREEN BOTH SIDES WITH BLACK NON-CONDUCTIVE INK | U7B | 4. 0.041" DRILLS MARK ENDS OF 3 PLATED SLOTS | (SEE DRILLS and MILLING PAGE) | 5. PLACE PCB VENDOR, UL94V0 CODE APPROX. WHERE SHOWN | ON TOP SILKSCREEN | 5. | Copyright (C) 2011 The Android Open Source Project | This work is licensed under the Creative Commons | Attribution-ShareAlike 3.0 Unported License. To view a copy of this | license, visit http://creativecommons.org/licenses/by-sa/3.0/ or send | a letter to Creative Commons, 171 Second Street, Suite 300, San | Francisco, California, 94105, USA. | Notes | 1